# Altium schematic sheet stm32f103cb_hm_main.SchDoc: Schemat pierwotny
size A4; DocumentNumber: 1; SheetNumber: 1; SheetTotal: 4; LotOfPieces: 1
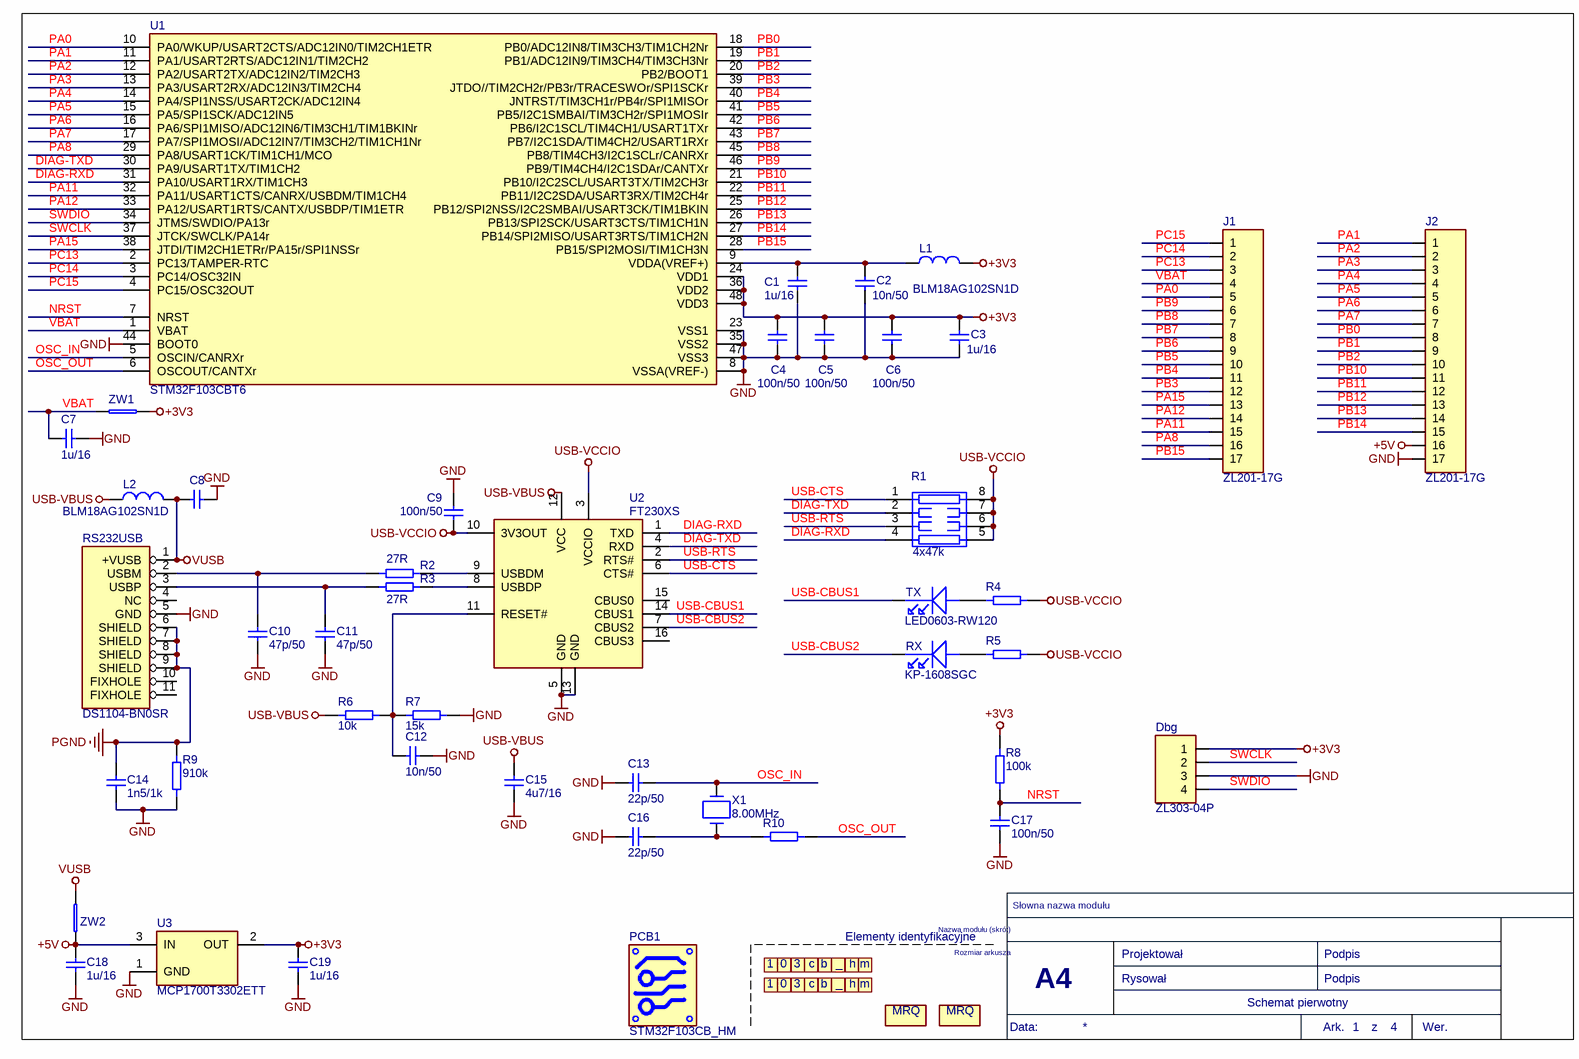
[diagram p0: stm32f103cb_hm_main.SchDoc]

## Parts
C1  1u/16  [0603-IPC]
C2  10n/50  [0603-IPC]
C3  1u/16  [0603-IPC]
C4  100n/50  [0603-IPC]
C5  100n/50  [0603-IPC]
C6  100n/50  [0603-IPC]
C7  1u/16  [0603-IPC]
C8  10n/50  [0603-IPC]  (value not drawn)
C9  100n/50  [0603-IPC]
C10  47p/50  [0603-IPC]
C11  47p/50  [0603-IPC]
C12  10n/50  [0603-IPC]
C13  22p/50  [0603-IPC]
C14  1n5/1k  [1210]
C15  4u7/16  [0805]
C16  22p/50  [0603-IPC]
C17  100n/50  [0603-IPC]
C18  1u/16  [0603-IPC]
C19  1u/16  [0603-IPC]
Dbg  ZL303-04P  [PLMS4S]
J1  ZL201-17G  [PLS17S]
J2  ZL201-17G  [PLS17S]
L1  BLM18AG102SN1D  [0603-IPC]
L2  BLM18AG102SN1D  [0603-IPC]
LETTER1  LETTER_1_1m2_m2  [LETTER_1_1m2_m2]  (value not drawn)  (no BOM)
LETTER2  LETTER_0_1m2_m2  [LETTER_0_1m2_m2]  (value not drawn)  (no BOM)
LETTER3  LETTER_3_1m2_m2  [LETTER_3_1m2_m2]  (value not drawn)  (no BOM)
LETTER4  LETTER_C_1m2_m2  [LETTER_C_1m2_m2]  (value not drawn)  (no BOM)
LETTER5  LETTER_B_1M2_M2  [LETTER_B_1M2_M2]  (value not drawn)  (no BOM)
LETTER6  LETTER_UNDERSCORE_1M2_M2  [LETTER_UNDERSCORE_1M2_M2]  (value not drawn)  (no BOM)
LETTER7  LETTER_H_1M2_M2  [LETTER_H_1M2_M2]  (value not drawn)  (no BOM)
LETTER8  LETTER_M_1M2_M2  [LETTER_M_1M2_M2]  (value not drawn)  (no BOM)
LETTER9  LETTER_1_1m2_m2  [LETTER_1_1m2_m2]  (value not drawn)  (no BOM)
LETTER10  LETTER_0_1m2_m2  [LETTER_0_1m2_m2]  (value not drawn)  (no BOM)
LETTER11  LETTER_3_1m2_m2  [LETTER_3_1m2_m2]  (value not drawn)  (no BOM)
LETTER12  LETTER_C_1m2_m2  [LETTER_C_1m2_m2]  (value not drawn)  (no BOM)
LETTER13  LETTER_B_1M2_M2  [LETTER_B_1M2_M2]  (value not drawn)  (no BOM)
LETTER14  LETTER_UNDERSCORE_1M2_M2  [LETTER_UNDERSCORE_1M2_M2]  (value not drawn)  (no BOM)
LETTER15  LETTER_H_1M2_M2  [LETTER_H_1M2_M2]  (value not drawn)  (no BOM)
LETTER16  LETTER_M_1M2_M2  [LETTER_M_1M2_M2]  (value not drawn)  (no BOM)
LOGO1  MRQ_2_8  [MRQ_2_8]  (value not drawn)  (no BOM)
LOGO2  MRQ_2_8  [MRQ_2_8]  (value not drawn)  (no BOM)
PCB1  STM32F103CB_HM  (mechanical)
R1  4x47k  [1206RP]
R2  27R  [0603R]
R3  27R  [0603R]
R4  10k  [0603R]  (value not drawn)
R5  10k  [0603R]  (value not drawn)
R6  10k  [0603R]
R7  15k  [0603R]
R8  100k  [0603R]
R9  910k  [2512]
R10  220R  [0603R]  (value not drawn)
RS232USB  DS1104-BN0SR  [USBMS1B5]
RX  KP-1608SGC  [D0603]
TX  LED0603-RW120  [D0603]
U1  STM32F103CBT6  [MS-026ABC]
U2  FT230XS  [MO-137AB]
U3  MCP1700T3302ETT  [SOT23-3]
X1  8.00MHz  [HC49/4HSMX_THT]
ZW1  SHORT0805  [SHORT0805]  (value not drawn)
ZW2  SHORT0805  [SHORT0805]  (value not drawn)  (no BOM)

## Nets
+3V3: C3.1 C4.1 C5.1 C6.1 C19.1 Dbg.1 L1.2 R8.1 U1.24(VDD1) U1.36(VDD2) U1.48(VDD3) U3.2(OUT) ZW1.2
+5V: C18.1 J2.16 U3.3(IN) ZW2.1
GND: C1.2 C2.2 C3.2 C4.2 C5.2 C6.2 C7.2 C8.1 C9.1 C10.2 C11.2 C12.1 C13.1 C14.2 C15.2 C16.1 C17.2 C18.2 C19.2 Dbg.3 J2.17 R7.2 R9.2 RS232USB.5(GND) U1.8(VSSA(VREF-)) U1.23(VSS1) U1.35(VSS2) U1.44(BOOT0) U1.47(VSS3) U2.5(GND) U2.13(GND) U3.1(GND)
PGND: C14.1 R9.1 RS232USB.6(SHIELD) RS232USB.7(SHIELD) RS232USB.8(SHIELD) RS232USB.9(SHIELD)
USB-VBUS: C15.1 L2.2 R6.1 U2.12(VCC)
USB-VCCIO: C9.2 R1.5(R5) R1.6(R6) R1.7(R7) R1.8(R8) R4.2 R5.2 U2.3(VCCIO) U2.10(3V3OUT)
VUSB: C8.2 L2.1 RS232USB.1(+VUSB) ZW2.2
DIAG-RXD: R1.4(R4) U1.31(PA10/USART1RX/TIM1CH3) U2.1(TXD)
DIAG-TXD: R1.2(R2) U1.30(PA9/USART1TX/TIM1CH2) U2.4(RXD)
NRST: C17.1 R8.2 U1.7(NRST)
OSC_IN: C13.2 U1.5(OSCIN/CANRXr) X1.1
OSC_OUT: R10.2 U1.6(OSCOUT/CANTXr)
PA0: J1.5 U1.10(PA0/WKUP/USART2CTS/ADC12IN0/TIM2CH1ETR)
PA1: J2.1 U1.11(PA1/USART2RTS/ADC12IN1/TIM2CH2)
PA2: J2.2 U1.12(PA2/USART2TX/ADC12IN2/TIM2CH3)
PA3: J2.3 U1.13(PA3/USART2RX/ADC12IN3/TIM2CH4)
PA4: J2.4 U1.14(PA4/SPI1NSS/USART2CK/ADC12IN4)
PA5: J2.5 U1.15(PA5/SPI1SCK/ADC12IN5)
PA6: J2.6 U1.16(PA6/SPI1MISO/ADC12IN6/TIM3CH1/TIM1BKINr)
PA7: J2.7 U1.17(PA7/SPI1MOSI/ADC12IN7/TIM3CH2/TIM1CH1Nr)
PA8: J1.16 U1.29(PA8/USART1CK/TIM1CH1/MCO)
PA11: J1.15 U1.32(PA11/USART1CTS/CANRX/USBDM/TIM1CH4)
PA12: J1.14 U1.33(PA12/USART1RTS/CANTX/USBDP/TIM1ETR)
PA15: J1.13 U1.38(JTDI/TIM2CH1ETRr/PA15r/SPI1NSSr)
PB0: J2.8 U1.18(PB0/ADC12IN8/TIM3CH3/TIM1CH2Nr)
PB1: J2.9 U1.19(PB1/ADC12IN9/TIM3CH4/TIM3CH3Nr)
PB2: J2.10 U1.20(PB2/BOOT1)
PB3: J1.12 U1.39(JTDO//TIM2CH2r/PB3r/TRACESWOr/SPI1SCKr)
PB4: J1.11 U1.40(JNTRST/TIM3CH1r/PB4r/SPI1MISOr)
PB5: J1.10 U1.41(PB5/I2C1SMBAI/TIM3CH2r/SPI1MOSIr)
PB6: J1.9 U1.42(PB6/I2C1SCL/TIM4CH1/USART1TXr)
PB7: J1.8 U1.43(PB7/I2C1SDA/TIM4CH2/USART1RXr)
PB8: J1.7 U1.45(PB8/TIM4CH3/I2C1SCLr/CANRXr)
PB9: J1.6 U1.46(PB9/TIM4CH4/I2C1SDAr/CANTXr)
PB10: J2.11 U1.21(PB10/I2C2SCL/USART3TX/TIM2CH3r)
PB11: J2.12 U1.22(PB11/I2C2SDA/USART3RX/TIM2CH4r)
PB12: J2.13 U1.25(PB12/SPI2NSS/I2C2SMBAI/USART3CK/TIM1BKIN)
PB13: J2.14 U1.26(PB13/SPI2SCK/USART3CTS/TIM1CH1N)
PB14: J2.15 U1.27(PB14/SPI2MISO/USART3RTS/TIM1CH2N)
PB15: J1.17 U1.28(PB15/SPI2MOSI/TIM1CH3N)
PC13: J1.3 U1.2(PC13/TAMPER-RTC)
PC14: J1.2 U1.3(PC14/OSC32IN)
PC15: J1.1 U1.4(PC15/OSC32OUT)
SWCLK: Dbg.2 U1.37(JTCK/SWCLK/PA14r)
SWDIO: Dbg.4 U1.34(JTMS/SWDIO/PA13r)
USB-CBUS1: TX.CATH U2.14(CBUS1)
USB-CBUS2: RX.CATH U2.7(CBUS2)
USB-CTS: R1.1(R1) U2.6(CTS#)
USB-RTS: R1.3(R3) U2.2(RTS#)
VBAT: C7.1 J1.4 U1.1(VBAT) ZW1.1
NetC1_1: C1.1 C2.1 L1.1 U1.9(VDDA(VREF+))
NetC10_1: C10.1 R2.1 RS232USB.2(USBM)
NetC11_1: C11.1 R3.1 RS232USB.3(USBP)
NetC12_2: C12.2 R6.2 R7.1 U2.11(RESET#)
NetC16_2: C16.2 R10.1 X1.2
NetR2_2: R2.2 U2.9(USBDM)
NetR3_2: R3.2 U2.8(USBDP)
NetR4_1: R4.1 TX.ANOD
NetR5_1: R5.1 RX.ANOD

Not connected (* = marked no-connect by the designer): RS232USB 4(NC) 10(FIXHOLE) 11(FIXHOLE); U2 15(CBUS0) 16(CBUS3)

## Notes on the sheet
- Elementy identyfikacyjne
- Nazwa modułu (skrót)
- Słowna nazwa modułu
- Rozmiar arkusza
- A4
- Projektował
- Rysował
- Podpis
- Data:
- Ark.
- z
- Wer.
- (in symbol NOB5) MRQ
- (in symbol NOB8) 0
- (in symbol NOB9) 1
- (in symbol NOB11) 3
- (in symbol NOB13) c
- (in symbol NOB15) b
- (in symbol NOB17) _
- (in symbol NOB19) h
- (in symbol NOB21) m

## Library data of the parts
C1 C3 C18 C19 = CAP37: Descript: Kondensator: ceramiczny; MLCC; 1uF; 16V; X7R; ±10%; SMD; 0603; Reference5: CL10B105KO8NNNC; Kod: CAP37; ID: 37; Value: 1u/16; Supplier5: tme.pl; Manufacturer5: Samsung; Typ5: CL10B105KO8NNNC; Price5: 0,1; DateOfPrice5: 2021-01-06
C2 C8 C12 = CAP20: Descript: Kondensator: ceramiczny; MLCC; 10nF; 50V; X7R; ±10%; SMD; 0603; Reference5: 06035C103KAT2A; Kod: CAP20; ID: 20; Value: 10n/50; Supplier5: tme.pl; Manufacturer5: AVX; Typ5: 06035C103KAT2A; Price5: 0,1; DateOfPrice5: 2021-01-06
C4-C6 C9 C17 = CAP6: Descript: Kondensator: ceramiczny; MLCC; 100nF; 50V; X7R; ±5%; SMD; 0603; Reference5: CL10B104JB8NNNC; Kod: CAP6; ID: 6; Value: 100n/50; Supplier5: tme.pl; Manufacturer5: Samsung; Typ5: CL10B104JB8NNNC; Price5: 0,25; DateOfPrice5: 2021-01-06
C7 = CAP37: Kod: CAP37; ID: 37; Descript: Kondensator: ceramiczny; MLCC; 1uF; 16V; X7R; ±10%; SMD; 0603; Reference5: CL10B105KO8NNNC; Value: 1u/16; Price5: 0,1; DateOfPrice5: 2021-01-06; Supplier5: tme.pl; Manufacturer5: Samsung; Typ5: CL10B105KO8NNNC
C10 C11 = CAP85: Descript: Kondensator: ceramiczny; MLCC; 47pF; 50V; C0G; ±5%; SMD; 0603; Reference5: CC0603JRNPO9470; Typ5: CC0603JRNPO9BN470; Kod: CAP85; ID: 85; Value: 47p/50; Supplier5: tme.pl; Manufacturer5: Yageo; Price5: 0,1; DateOfPrice5: 2021-01-06
C13 C16 = CAP53: Descript: Kondensator: ceramiczny; MLCC; 22pF; 50V; C0G; ±5%; SMD; 0603; Reference5: CC0603JRNPO9220; Typ5: CC0603JRNPO9BN220; Kod: CAP53; ID: 53; Value: 22p/50; Supplier5: tme.pl; Manufacturer5: Yageo; Price5: 0,1; DateOfPrice5: 2021-01-06
C14 = CAP35: Descript: Ceramiczny kondensator wielowarstw. SMD, 1210 [jedn. metryczne: 3225], 1500 pF, 1 kV, ± 10%, X7R; Reference5: 1855964; Typ5: MCCA000836; Kod: CAP35; ID: 35; Value: 1n5/1k; DateOfPrice5: 2021-01-06; Manufacturer5: MULTICOMP; Price5: 2,4; Supplier5: farnell.com
C15 = CAP97: Descript: Kondensator: ceramiczny; MLCC; 4,7uF; 16VDC; X7R; ±5%; SMD; 0805; Reference5: C0805C475J4RACAUTO; Kod: CAP97; ID: 97; Value: 4u7/16; Supplier5: tme.pl; Manufacturer5: Kemet; Typ5: C0805C475J4RACAUTO; Price5: 1,5; DateOfPrice5: 2021-01-06
Dbg = Con298: Descript: Listwa kołkowa; kołkowe; męskie; PIN:4; proste; 2mm; THT; 1x4; Kod: Con298; ID: 298; Replacement: bd; Value: ZL303-04P; Supplier5: tme.pl; Reference5: ZL303-04P; Manufacturer5: Ninigi; Typ5: ZL303-04P; Price5: 0,2; DateOfPrice5: 2021-01-06
J1 J2 = CON82: Kod: CON82; ID: 82; Descript: Listwa kołkowa; kołkowe; męskie; PIN: 20; proste; 2,54mm; THT; 1x20; Reference5: ZL201-20G; Typ5: DS1021-1*20SF11; Replacement: bd; Value: ZL201-17G; Price5: 1; DateOfPrice5: 2021-01-06; Supplier5: tme; Manufacturer5: Connfly
L1 L2 = Ind41: Descript: Ferryt: koralik; Imp.@ 100MHz:1000om; Montaż: SMD; 0,4A; Obud:0603; Kod: Ind41; ID: 41; Value: BLM18AG102SN1D; Supplier5: tme.pl; Reference5: BLM18AG102SN1D; Manufacturer5: Murata; Typ5: BLM18AG102SN1D; Price5: 0,3; DateOfPrice5: 2021-01-06; InductCurr: -
LETTER1 LETTER9 = NOB9: Kod: NOB9; ID: 9; Descript: bd; Value: LETTER_1_1m2_m2
LETTER2 LETTER10 = NOB8: Kod: NOB8; ID: 8; Descript: bd; Value: LETTER_0_1m2_m2
LETTER3 LETTER11 = NOB11: Kod: NOB11; ID: 11; Descript: bd; Value: LETTER_3_1m2_m2
LETTER4 LETTER12 = NOB13: Kod: NOB13; ID: 13; Descript: bd; Value: LETTER_C_1m2_m2
LETTER5 LETTER13 = NOB15: Kod: NOB15; ID: 15; Descript: bd; Value: LETTER_B_1M2_M2
LETTER6 LETTER14 = NOB17: Kod: NOB17; ID: 17; Descript: bd; Value: LETTER_UNDERSCORE_1M2_M2
LETTER7 LETTER15 = NOB19: Kod: NOB19; ID: 19; Descript: bd; Value: LETTER_H_1M2_M2
LETTER8 LETTER16 = NOB21: Kod: NOB21; ID: 21; Descript: bd; Value: LETTER_M_1M2_M2
LOGO1 LOGO2 = NOB5: Kod: NOB5; ID: 5; Descript: bd; Value: MRQ_2_8
PCB1 = Pcb47: Kod: Pcb47; ID: 47; Descript: miedź: dwustronna; solder: góra dół; opis: góra; laminat: standard, prototyp; Value: STM32F103CB_HM; Price5: 20; DateOfPrice5: 2021-01-10; Supplier5: Allpcb; Reference5: STM32F103CB_HM; Manufacturer5: Allpcb
R1 = Res182: Descript: Drabinka rezystorowa: Y; 47kΩ; SMD; 1206; Il.rezystorów:4; 63mW; Reference5: DR1206-47K-4/8; Typ5: 4D03WGJ0473T; Kod: Res182; ID: 182; Value: 4x47k; Supplier5: tme.pl; Manufacturer5: Royal Ohm; Price5: 0,1; DateOfPrice5: 2021-01-06
R2 R3 = Res106: Descript: Rezystor: thick film; SMD; 0603; 27Ω; 0,1W; ±1%; -55÷125°C; Reference5: SMD0603-27R-1%; Typ5: 0603SAF270JT5E; Kod: Res106; ID: 106; Value: 27R; Supplier5: tme.pl; Manufacturer5: Royal Ohm; Price5: 0,1; DateOfPrice5: 2021-01-06
R4-R6 = Res15: Descript: Rezystor: thick film; SMD; 0603; 10kom; 0,1W; ±1%; -55÷125°C; Reference5: SMD0603-10K-1%; Typ5: 0603WGF 10K T5E; Kod: Res15; ID: 15; Value: 10k; Supplier5: tme.pl; Manufacturer5: Royal Ohm; Price5: 0,1; DateOfPrice5: 2021-01-06
R7 = Res39: Descript: Rezystor: thick film; SMD; 0603; 15kΩ; 0,1W; ±1%; -55÷125°C; Reference5: SMD0603-15K-1%; Typ5: 0603WGF15KT5E; Kod: Res39; ID: 39; Value: 15k; Supplier5: tme.pl; Manufacturer5: Royal Ohm; Price5: 0,12; DateOfPrice5: 2021-01-06
R8 = Res9: Descript: Rezystor: thick film; SMD; 0603; 100kom; 0,1W; ±1%; -55÷125°C; Reference5: SMD0603-100K-1%; Typ5: 0603SAF1003T5E; Kod: Res9; ID: 9; Value: 100k; Supplier5: tme.pl; Manufacturer5: Royal Ohm; Price5: 0,12; DateOfPrice5: 2021-01-06
R9 = Res235: Descript: Rezystor SMD, grubowarstwowy, 2512 [jedn. metryczne: 6432], 910 kohm, Seria ERJU1T, 200 V; Reference5: 2381073; Typ5: ERJU1TF9103U; Kod: Res235; ID: 235; Value: 910k; Supplier5: farnell; Price5: 1,14; DateOfPrice5: 2021-01-06; Manufacturer5: Panasonic
R10 = Res87: Descript: Rezystor: thick film; SMD; 0603; 220om; 0,1W; ±1%; -55÷125°C; Reference5: SMD0603-220R-1%; Typ5: 0603SAF2200T5E; Kod: Res87; ID: 87; Value: 220R; Supplier5: tme.pl; Manufacturer5: Royal Ohm; Price5: 0,1; DateOfPrice5: 2021-01-06
RS232USB = Con41: Descript: Gniazdo; USB B mini; SMT; PIN: 5; poziome; Opakowanie: taśma; Reference5: MUSB-G5P; Replacement: bd; Kod: Con41; ID: 41; Value: DS1104-BN0SR; Supplier5: tme.pl; Manufacturer5: Connfly; Price5: 2,3; DateOfPrice5: 2021-01-06; Typ5: DS1104-BN0SR
RX = Opt8: Descript: LED; SMD; 0603; zielony; 4-15mcd; 120°; 1,6x0,8mm; Kod: Opt8; ID: 8; Value: KP-1608SGC; Supplier5: tme.pl; Reference5: KP-1608SGC; Manufacturer5: Kingbright Electronic; Typ5: KP-1608SGC; Price5: 1; DateOfPrice5: 2021-01-06
TX = Opt25: Descript: Dioda LED, SMD 0603, Czerwona 626-636nm, 50-70 mCd /10mA, water clear, 120°; Kod: Opt25; ID: 25; Value: LED0603-RW120; Supplier5: maritex.com.pl; Reference5: LED0603-RW120; Typ5: LED0603-RW120; Price5: 0,12; DateOfPrice5: 2021-01-06; Manufacturer5: Honglitronic
U1 = ICs272: Kod: ICs272; ID: 272; Descript: ARM Cortex-M3 CPU, 128kB Flash, 20kB RAM, USB, CAN, 3xUART, 2xI2C, 2xSPI, ADC, STM, LQFP48, RoHS; Reference5: 42865; Value: STM32F103CBT6; Price5: 18; DateOfPrice5: 2021-01-06; Supplier5: kamami.pl; Manufacturer5: ST; Typ5: STM32F103CBT6
U2 = ICs109: Descript: Interfejs; USB-basic UART; Ilość pinów CBUS:4; tuba; SSOP16; Reference5: FT230XS-R; Kod: ICs109; ID: 109; Value: FT230XS; Supplier5: tme.pl; Manufacturer5: FTDI; Typ5: FT230XS-R; Price5: 8,8; DateOfPrice5: 2021-01-06
U3 = ICs182: Kod: ICs182; ID: 182; Descript: Stabilizator napięcia; LDO, nieregulowany; 3,3V; 0,25A; SOT23-3; Typ5: MCP1700T3302E/TT; Value: MCP1700T3302ETT; Price5: 1,8; DateOfPrice5: 2021-01-06; Supplier5: tme.pl; Reference5: MCP1700T3302ETT; Manufacturer5: Microchip
X1 = Qua16: Descript: Rezonator: kwarcowy; 8MHz; ±30ppm; 20pF; SMD; HC49SM; Reference5: 8.00M-SMDHC49S; Kod: Qua16; ID: 16; Value: 8.00MHz; Supplier5: tme.pl; Manufacturer5: YIC; Price5: 2; DateOfPrice5: 2021-01-06; Freq: 8.00MHz; Typ5: -
ZW1 = Res238: Kod: Res238; ID: 238; Descript: Przewlekana zwora z drutu na planie rezystora 0805; Value: SHORT0805; Price5: 0,1; Supplier5: -; Reference5: -; Manufacturer5: -; Typ5: -; DateOfPrice5: 2021-01-06
ZW2 = NOB39: Kod: NOB39; ID: 39; Descript: bd; Value: SHORT0805